# Altium schematic sheet Voltage Regulator.SchDoc
size Letter; Organization: Midnight Sun Solar Rayce Car Team; Address1: University of Waterloo; Address2: 200 University Ave W; Address3: Waterloo, ON, Canada; Address4: N2L 3E9; Website: www.uwmidsun.com
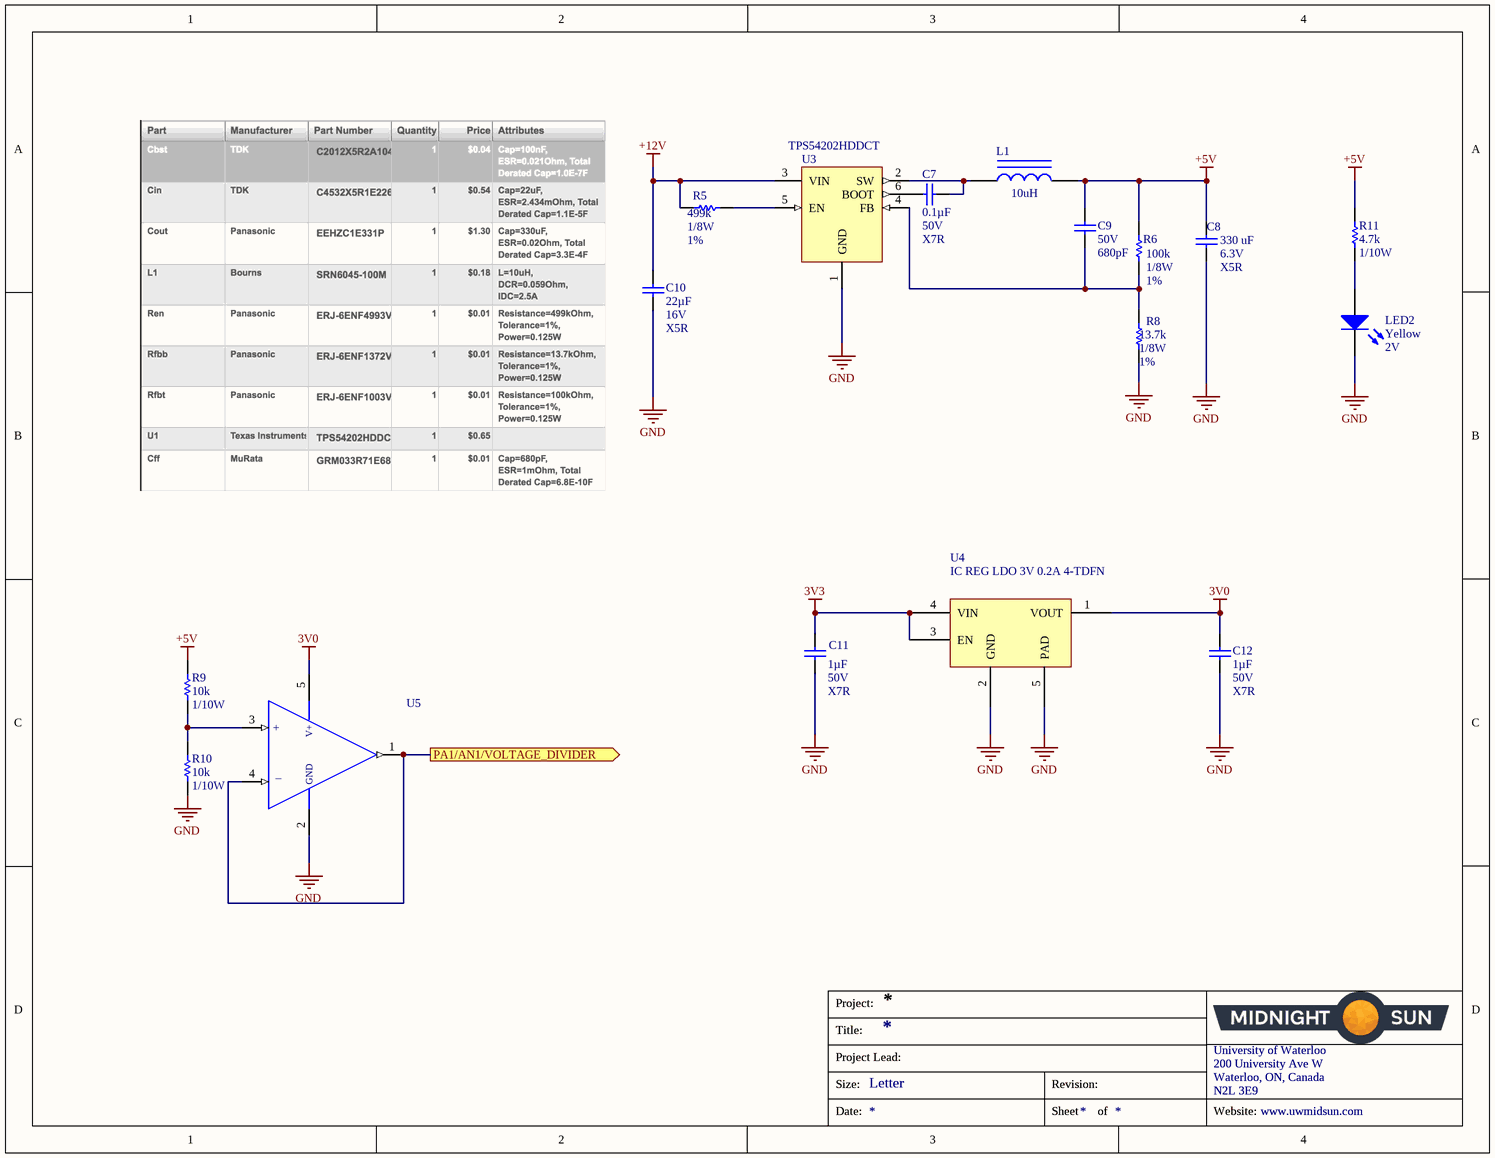
[diagram p0: Voltage Regulator.SchDoc]

## Parts
C7  Capacitance: 0.1µF  Voltage: 50V  Temperature Coefficient: X7R  [CAP, 0603]  (hidden comment: CAP CER 0.1UF 50V 10% X7R 0603)
C8  Capacitance: 330 uF  Voltage: 6.3V  Temperature Coefficient: X5R  [CAP, 1210]  (hidden comment: CAP CER 330UF 6.3V X5R 1210)
C9  Voltage: 50V  Capacitance: 680pF  [CAP, 0603]  (hidden comment: CAP CER 680PF 50V C0G/NP0 0603)
C10  Capacitance: 22µF  Voltage: 16V  Temperature Coefficient: X5R  [CAP, 1210]  (hidden comment: CAP CER 22UF 16V ±20% X5R 1210)
C11  Capacitance: 1µF  Voltage: 50V  Temperature Coefficient: X7R  [CAP, 0603]  (hidden comment: CAP CER 1UF 50V 10% X7R 0603)
C12  Capacitance: 1µF  Voltage: 50V  Temperature Coefficient: X7R  [CAP, 0603]  (hidden comment: CAP CER 1UF 50V 10% X7R 0603)
L1  Inductance: 10uH  [INDP100102X31N]  (hidden comment: IND 10UH 2.8A 59 MOHM SMD)
LED2  Color: Yellow  Voltage - Forward (Vf) (Typ): 2V  [LED_0603]  (hidden comment: LED YELLOW CLEAR 2.1V 0603)
R5  Resistance: 499k  Tolerance: 1%  Max Power Dissipation: 1/8W  [RES 1206]  (hidden comment: RES 499K OHM 1% 1/4W 1206)
R6  Tolerance: 1%  Resistance: 100k  Power Rating: 1/8W  [RES 1206]  (hidden comment: ES 100K OHM 1% 1/4W 1206)
R8  Resistance: 13.7k  Tolerance: 1%  Power Rating: 1/8W  [RES 1206]  (hidden comment: RES 13.7K OHM 1% 1/4W 1206)
R9  Resistance: 10k  Power: 1/10W  [RES, 0603]  (hidden comment: RES 10K OHM 1% 1/10W 0603)
R10  Resistance: 10k  Power: 1/10W  [RES, 0603]  (hidden comment: RES 10K OHM 1% 1/10W 0603)
R11  Resistance (Ohms): 4.7k  Power (Watts): 1/10W  [RES, 0603]  (hidden comment: RES 4.7K OHM 1% 1/10W 0603)
U3  Manufacturer Part Number: TPS54202HDDCT  [SOT23-6]  (hidden comment: IC REG BUCK ADJ 2A SYNC 6SOT)
U4  IC REG LDO 3V 0.2A 4-TDFN  [IC REG LDO 3V 0.2A 4-TDFN]
U5  IC OP AMP GEN PURPOSE RR 10MHZ SOT-23-5  [IC OP AMP GP RR 10MHZ SOT-23-5]  (value not drawn)

## Ports
PA1/AN1/VOLTAGE_DIVIDER (out)

## Nets
3V0: C12.1 U4.1(VOUT) U5.5(VDD)
3V3: C11.1 U4.3(EN) U4.4(VIN)
+5V: C8.1 C9.1 L1.2 R6.1 R9.1 R11.1
+12V: C10.1 R5.2 U3.3(VIN)
GND: C8.2 C10.2 C11.2 C12.2 LED2.2(K) R8.2 R10.2 U3.1(GND) U4.2(GND) U4.5(PAD) U5.2(VSS)
PA1/AN1/VOLTAGE_DIVIDER: U5.1(OUTPUT) U5.4(-IN) ; port PA1/AN1/VOLTAGE_DIVIDER
NetC7_1: C7.1 U3.6(BOOT)
NetC7_2: C7.2 L1.1 U3.2(SW)
NetC9_2: C9.2 R6.2 R8.1 U3.4(FB)
NetLED2_1: LED2.1(A) R11.2
NetR5_1: R5.1 U3.5(EN)
NetR9_2: R9.2 R10.1 U5.3(+IN)

## Notes on the sheet
- Project:
- Title:
- Size:
- Project Lead:
- Letter
- Revision:
- University of Waterloo
- 200 University Ave W
- Waterloo, ON, Canada
- N2L 3E9
- Date:
- Sheet
- of
- Website:
- (in symbol IC OP AMP GEN PURPOSE RR 10MHZ SOT-23-5) V+; +; GND; _

## Library data of the parts
C7 = CAP CER 0.1UF 50V 10% X7R 0603: 0.10µF ±10% 50V Ceramic Capacitor X7R 0603 (1608 Metric); Manufacturer 1: AVX Corporation; Manufacturer Part Number 1: 06035C104KAT2A; Supplier 1: Digi-Key; Supplier Part Number 1: 478-5052-1-ND; Packaging: Cut Tape (CT); Part Status: Active; Operating Temperature: -55°C ~ 125°C; Ratings: -; Mounting Type: Surface Mount, MLCC; Package / Case: 0603 (1608 Metric); Size / Dimension: 0.063" L x 0.032" W (1.60mm x 0.81mm); Height - Seated (Max): -; Thickness (Max): 0.035" (0.90mm); Lead Spacing: -; Lead Style: -; ComponentLink1URL: http://datasheets.avx.com/X7RDielectric.pdf; ComponentLink1Description: http://datasheets.avx.com/X7RDielectric.pdf; Tolerance: ±10%
C8 = CAP CER 330UF 6.3V X5R 1210: 330µF ±20% 6.3V Ceramic Capacitor X5R 1210 (3225 Metric); Manufacturer: Taiyo Yuden; Manufacturer Part Number: JMK325ABJ337MM-P; Supplier 1: Digi-Key; Stock 1: 334; Pricing 1: 1=5.57, 10=4.492, 100=3.5039, 500=2.60546 (USD); ComponentLink1URL: http://ds.yuden.co.jp/TYCOMPAS/ut/detail.do?productNo=JMK325ABJ337MM-P&fileName=JMK325ABJ337MM-P_SS&mode=specSheetDownload; ComponentLink1Description: http://ds.yuden.co.jp/TYCOMPAS/ut/detail.do?productNo=JMK325ABJ337MM-P&fileName=JMK325ABJ337MM-P_SS&mode=specSheetDownload; Supplier Part Number 1: 587-5449-1-ND
C9 = CAP CER 680PF 50V C0G 0603: 680pF ±5% 50V Ceramic Capacitor C0G, NP0 0603 (1608 Metric); Manufacturer: Samsung; Manufacturer Part Number: CL10C681JB8NNNC; Temperature Coefficient: 300ppm/°C; Supplier 1: Digi-Key; Stock 1: 40000; Pricing 1: 1=0.16, 10=0.112, 100=0.0526, 500=0.0369, 1000=0.03055 (USD); Mount: Surface Mount; Case/Package: 0603; Case Code (Metric): 1608; Case Code (Imperial): 0603; Material: Ceramic; Min Operating Temperature: -55°C; Max Operating Temperature: 125°C; Tolerance: 5%; Packaging: Tape and Reel; Voltage Rating: 50V; Dielectric: C0G; Voltage Rating (DC): 50V; Length: 1.6mm; Height: 0.8mm; Width: 0.031inch; Thickness: 0.035inch; Depth: 0.8mm; Radiation Hardening: No; Lead Free: Lead Free; ComponentLink1URL: http://www.samsungsem.com/kr/support/product-search/mlcc/CL10C681JB8NNNC.jsp; ComponentLink1Description: http://www.samsungsem.com/kr/support/product-search/mlcc/CL10C681JB8NNNC.jsp; ComponentLink2URL: https://www.verical.com/server-webapp/html/getDatasheet?partID=359565; ComponentLink2Description: https://www.verical.com/server-webapp/html/getDatasheet?partID=359565; ComponentLink3URL: http://www1.futureelectronics.com/doc/SAMSUNG%20PASSIVE/CL05B104KQ5NNNC.pdf; ComponentLink3Description: http://www1.futureelectronics.com/doc/SAMSUNG%20PASSIVE/CL05B104KQ5NNNC.pdf; ComponentLink4URL: http://www.rapidonline.com/pdf/71-0310.pdf; ComponentLink4Description: http://www.rapidonline.com/pdf/71-0310.pdf; ComponentLink5URL: https://www.distrelec.biz/Web/Downloads/_e/ng/MLCC_CatalogDownload2013_ENG.pdf?mime=application%2Fpdf; ComponentLink5Description: https://www.distrelec.biz/Web/Downloads/_e/ng/MLCC_CatalogDownload2013_ENG.pdf?mime=application%2Fpdf; ComponentLink6URL: https://produktinfo.conrad.com/datenblaetter/450000-474999/456146-da-01-en-VS_KONDENSATOR_0603.pdf; ComponentLink6Description: https://produktinfo.conrad.com/datenblaetter/450000-474999/456146-da-01-en-VS_KONDENSATOR_0603.pdf; Supplier Part Number 1: 1276-1820-1-ND
C10 = CAP CER 22UF 16V ±20% X5R 1210: 22µF ±20% 16V Ceramic Capacitor X5R 1210 (3225 Metric); Manufacturer 1: Murata Electronics North America; Manufacturer Part Number 1: GRM32ER61C226ME20L; Supplier 1: Digi-Key; Supplier Part Number 1: 490-1881-1-ND; Packaging: Cut Tape (CT); Part Status: Active; Operating Temperature: -55°C ~ 85°C; Ratings: -; Mounting Type: Surface Mount, MLCC; Package / Case: 1210 (3225 Metric); Size / Dimension: 0.126" L x 0.098" W (3.20mm x 2.50mm); Height - Seated (Max): -; Thickness (Max): 0.106" (2.70mm); Lead Spacing: -; Lead Style: -; ComponentLink1URL: http://www.murata.com/~/media/webrenewal/support/library/catalog/products/capacitor/mlcc/c02e.ashx; ComponentLink1Description: http://www.murata.com/~/media/webrenewal/support/library/catalog/products/capacitor/mlcc/c02e.ashx; Tolerance: ±20%
C11 C12 = CAP CER 1UF 50V 10% X7R 0603: 1µF ±10% 50V Ceramic Capacitor X7R 0603 (1608 Metric); Manufacturer 1: Taiyo Yuden; Manufacturer Part Number 1: UMK107AB7105KA-T; Supplier 1: Digi-Key; Supplier Part Number 1: 587-3247-1-ND; Packaging: Cut Tape (CT); Part Status: Active; Operating Temperature: -55°C ~ 125°C; Ratings: -; Mounting Type: Surface Mount, MLCC; Package / Case: 0603 (1608 Metric); Size / Dimension: 0.063" L x 0.031" W (1.60mm x 0.80mm); Height - Seated (Max): -; Thickness (Max): 0.037" (0.95mm); Lead Spacing: -; Lead Style: -; ComponentLink1URL: http://www.yuden.co.jp/productdata/catalog/en/mlcc_all_e.pdf; ComponentLink1Description: http://www.yuden.co.jp/productdata/catalog/en/mlcc_all_e.pdf; Tolerance: ±10%
L1 = IND 10UH 2.8A 59 MOHM SMD: 10µH Shielded Inductor 2.8A 59 mOhm Max Nonstandard; Manufacturer: Sumida; Manufacturer Part Number: CDRH103RNP-100NC-B; Core Material: Ferrite; Tolerance: 30%; Saturation Current: 3.18A; DC Resistance (DCR): 59mR; Test Frequency: 100kHz; Supplier 1: Digi-Key; Stock 1: 69; Pricing 1: 1=1.53, 10=1.42, 100=1.027, 500=0.7866 (USD); Mount: Surface Mount; Case/Package: Nonstandard; Min Operating Temperature: -40°C; Max Operating Temperature: 100°C; Packaging: Tape and Reel; Package Quantity: 1000; Current Rating: 2.8A; Shielding: Shielded; Max DC Current: 2.8A; Termination: SMD/SMT; Length: 0.402inch; Height: 3.1mm; Width: 0.394inch; Height - Seated (Max): 0.122inch; Depth: 10.3mm; Radiation Hardening: No; Lead Free: Lead Free; ComponentLink1URL: http://www.mouser.com/ds/2/390/CDRH103R-523372.pdf; ComponentLink1Description: http://www.mouser.com/ds/2/390/CDRH103R-523372.pdf; ComponentLink2URL: http://www.sumida.com/products/pdf/CDRH103R.pdf; ComponentLink2Description: http://www.sumida.com/products/pdf/CDRH103R.pdf; ComponentLink3URL: http://products.sumida.com/products/pdf/CDRH103R.pdf; ComponentLink3Description: http://products.sumida.com/products/pdf/CDRH103R.pdf; Supplier Part Number 1: 308-1910-1-ND
LED2 = LED YELLOW CLEAR 2.1V 0603: Yellow 590nm LED Indication - Discrete 2V 0603 (1608 Metric); Manufacturer: Wurth Electronics Inc.; Manufacturer Part Number: 150060YS75000; Lens Color: Colorless; Millicandela Rating: 120mcd; Lens Style/Size: Rectangle with Flat Top, 1.10mm x 0.70mm; Current - Test: 20mA; Viewing Angle: 140°; Wavelength - Peak: 595nm; Supplier 1: Digi-Key; RoHS: RoHS Compliant; Category: Optoelectronics; Stock 1: 10523; Pricing 1: 1=0.21, 100=0.1617, 500=0.13964 (CAD); Packaging: Cut Tape (CT); Part Status: Active; Lens Transparency: Clear; Mounting Type: Surface Mount; Wavelength - Dominant: 590nm; Features: -; Package / Case: 0603 (1608 Metric); Supplier Device Package: 0603; Size / Dimension: 1.60mm L x 0.80mm W; Height (Max): 0.80mm; ComponentLink1URL: http://katalog.we-online.de/led/datasheet/150060YS75000.pdf; ComponentLink1Description: http://katalog.we-online.de/led/datasheet/150060YS75000.pdf; Supplier Part Number 1: 732-4981-1-ND
R5 = RES 499K OHM 1% 1/4W 1206: Manufacturer: Stackpole Electronics; Manufacturer Part Number: RMCF1206FT499K; Temperature Coefficient: 100ppm/°C; Supplier 1: Digi-Key; Stock 1: 60246; Pricing 1: 1=0.1, 10=0.035, 100=0.0141, 1000=0.00635, 2500=0.00552 (USD); Mount: Surface Mount; Case/Package: 1206; Case Code (Metric): 3216; Case Code (Imperial): 1206; Contact Plating: Tin,Matte; Min Operating Temperature: -55°C; Max Operating Temperature: 155°C; Packaging: Tape and Reel; Composition: Thick Film; Number of Terminations: 2; Length: 0.126inch; Height: 0.028inch; Width: 0.063inch; Radiation Hardening: No; ComponentLink1URL: https://www.seielect.com/Catalog/SEI-RMCF_RMCP.pdf; ComponentLink1Description: https://www.seielect.com/Catalog/SEI-RMCF_RMCP.pdf; ComponentLink2URL: http://components.arrow.com/part/dataview/50498553S9833735N1174; ComponentLink2Description: http://components.arrow.com/part/dataview/50498553S9833735N1174; Supplier Part Number 1: RMCF1206FT499KCT-ND
R6 = RES 100K OHM 1% 1/4W 1206: 100 kOhms ±1% 0.25W, 1/4W Chip Resistor 1206 (3216 Metric) Moisture Resistant Thick Film; Manufacturer: Yageo; Manufacturer Part Number: RC1206FR-07100KL; Temperature Coefficient: 100ppm/°C; Voltage Rating: 200V; Supplier 1: Digi-Key; Stock 1: 1498131; Pricing 1: 1=0.1, 10=0.033, 100=0.0136, 1000=0.0061, 2500=0.00529 (USD); Case/Package: 1206; Case Code (Imperial): 1206; Case Code (Metric): 3216; Min Operating Temperature: -55°C; Max Operating Temperature: 155°C; Packaging: Tape and Reel; Termination: SMD/SMT; Composition: Thick Film; Length: 3.1mm; Height: 0.55mm; Depth: 1.6mm; REACH SVHC: No SVHC; Lead Free: Lead Free; ComponentLink1URL: https://datasheet.ciiva.com/7857/444357-7857239.pdf; ComponentLink1Description: https://datasheet.ciiva.com/7857/444357-7857239.pdf; ComponentLink2URL: https://datasheet.ciiva.com/7857/444357-7857240.pdf; ComponentLink2Description: https://datasheet.ciiva.com/7857/444357-7857240.pdf; ComponentLink3URL: https://datasheet.ciiva.com/16997/pyu-rc1206-51-rohs-l-4-16997053.pdf; ComponentLink3Description: https://datasheet.ciiva.com/16997/pyu-rc1206-51-rohs-l-4-16997053.pdf; Supplier Part Number 1: 311-100KFRCT-ND
R8 = RES 13.7K OHM 1% 1/4W 1206: 13.7 kOhms ±1% 0.25W, 1/4W Chip Resistor 1206 (3216 Metric) Moisture Resistant Thick Film; Manufacturer: Yageo; Manufacturer Part Number: RC1206FR-0713K7L; Voltage Rating: 200V; Temperature Coefficient: 100ppm/°C; Supplier 1: Digi-Key; Stock 1: 44928; Pricing 1: 1=0.1, 10=0.033, 100=0.0136, 1000=0.0061, 2500=0.00529 (USD); Case/Package: 1206; Case Code (Imperial): 1206; Case Code (Metric): 3216; Contact Plating: Tin,Matte; Min Operating Temperature: -55°C; Max Operating Temperature: 155°C; Packaging: Tape and Reel; Termination: SMD/SMT; Composition: Thick Film; Military Standard: Not; Voltage Rating (DC): 200V; Length: 3.1mm; Height: 0.55mm; Width: 1.6mm; Depth: 1.6mm; Radiation Hardening: No; Lead Free: Lead Free; ComponentLink1URL: http://components.arrow.com/part/dataview/0323_03537901; ComponentLink1Description: http://components.arrow.com/part/dataview/0323_03537901; ComponentLink2URL: http://www.yageo.com/documents/recent/PYu-RC_Group_51_RoHS_L_2.pdf; ComponentLink2Description: http://www.yageo.com/documents/recent/PYu-RC_Group_51_RoHS_L_2.pdf; ComponentLink3URL: http://www.yageo.com/documents/recent/PYu-RC1206_51_RoHS_L-4.pdf; ComponentLink3Description: http://www.yageo.com/documents/recent/PYu-RC1206_51_RoHS_L-4.pdf; ComponentLink4URL: http://www.yageo.com.tw/exep/pages/download/literatures/PYu-R_INT-thick_7.pdf; ComponentLink4Description: http://www.yageo.com.tw/exep/pages/download/literatures/PYu-R_INT-thick_7.pdf; ComponentLink5URL: http://www.mouser.com/ds/2/447/PYu-RC1206_51_RoHS_L-4-349080.pdf; ComponentLink5Description: http://www.mouser.com/ds/2/447/PYu-RC1206_51_RoHS_L-4-349080.pdf; ComponentLink6URL: http://www.yageo.com/documents/recent/PYu-RC1206_51_RoHS_L_5.pdf; ComponentLink6Description: http://www.yageo.com/documents/recent/PYu-RC1206_51_RoHS_L_5.pdf; Supplier Part Number 1: 311-13.7KFRCT-ND
R9 R10 = RES 10K OHM 1% 1/10W 0603: RES SMD 10K OHM 1% 1/10W 0603; Manufacturer 1: Yageo; Manufacturer Part Number 1: RC0603FR-0710KL; Temperature Coefficient: ±100ppm/°C; Supplier 1: Digi-Key; Supplier Part Number 1: 311-10.0KHRCT-ND; Packaging: Cut Tape (CT); Part Status: Active; Composition: Thick Film; Operating Temperature: -55°C ~ 155°C; Package / Case: 0603 (1608 Metric); Supplier Device Package: 0603; Size / Dimension: 0.063" L x 0.031" W (1.60mm x 0.80mm); Height - Seated (Max): 0.022" (0.55mm); Failure Rate: -; ComponentLink1URL: http://www.yageo.com/documents/recent/PYu-RC_Group_51_RoHS_L_7.pdf; ComponentLink1Description: http://www.yageo.com/documents/recent/PYu-RC_Group_51_RoHS_L_7.pdf; Tolerance: ±1%
R11 = RES 4.7K OHM 1% 1/10W 0603: 4.7k Ohm ±1% 0.1W, 1/10W Chip Resistor 0603 (1608 Metric) Moisture Resistant Thick Film; Manufacturer 1: Yageo; Manufacturer Part Number 1: RC0603FR-074K7L; Description 1: RES SMD 4.7K OHM 1% 1/10W 0603; Temperature Coefficient: ±100ppm/°C; Supplier 1: Digi-Key; Supplier Part Number 1: 311-4.70KHRCT-ND; RoHS: RoHS Compliant; Category: Resistors; Stock 1: 3487566; Pricing 1: 1=0.16, 10=0.022, 100=0.0089, 1000=0.00402, 2500=0.00349 (CAD); Packaging: Cut Tape (CT); Part Status: Active; Composition: Thick Film; Features: Moisture Resistant; Operating Temperature: -55°C ~ 155°C; Package / Case: 0603 (1608 Metric); Supplier Device Package: 0603; Size / Dimension: 0.063" L x 0.031" W (1.60mm x 0.80mm); Height - Seated (Max): 0.022" (0.55mm); Failure Rate: -; ComponentLink1URL: http://www.yageo.com/documents/recent/PYu-RC_Group_51_RoHS_L_7.pdf; ComponentLink1Description: http://www.yageo.com/documents/recent/PYu-RC_Group_51_RoHS_L_7.pdf; Tolerance: ±1%
U3 = IC REG BUCK ADJ 2A SYNC 6SOT: Buck Switching Regulator IC Positive Adjustable 0.596V 1 Output 2A SOT-23-6 Thin, TSOT-23-6; Manufacturer: Texas Instruments; Min Input Voltage: 4.5V; Max Input Voltage: 28V; Number of Outputs: 1; Min Output Voltage: 600mV; Max Output Voltage: 26V; Switching Frequency: 500kHz; Quiescent Current: 40uA; Supplier 1: Digi-Key; Stock 1: 2574; Pricing 1: 1=2, 10=1.796, 100=1.4436 (USD); Case/Package: SOT-6; Number of Pins: 6; Min Operating Temperature: -40°C; Max Operating Temperature: 125°C; Output Current: 2A; Packaging: Cut Tape; Output Voltage: 26V; REACH SVHC: No SVHC; Lead Free: Lead Free; ComponentLink1URL: http://www.ti.com/lit/ds/symlink/tps54202h.pdf; ComponentLink1Description: http://www.ti.com/lit/ds/symlink/tps54202h.pdf; ComponentLink2URL: http://www.ti.com/general/docs/lit/getliterature.tsp?genericPartNumber=TPS54202H&amp;&amp;fileType=pdf; ComponentLink2Description: http://www.ti.com/general/docs/lit/getliterature.tsp?genericPartNumber=TPS54202H&amp;&amp;fileType=pdf; ComponentLink3URL: http://www.ti.com/general/docs/lit/getliterature.tsp?genericPartNumber=TPS54202H&&fileType=pdf; ComponentLink3Description: http://www.ti.com/general/docs/lit/getliterature.tsp?genericPartNumber=TPS54202H&&fileType=pdf; Supplier Part Number 1: 296-44497-1-ND
U4 = IC REG LDO 3V 0.2A 4-TDFN: Manufacturer: Microchip Technology; Manufacturer Part Number: MIC94310-PYMT-TR; Regulator Topology: Positive Fixed; Current - Output: 200mA; Voltage - Dropout (Typical): 0.04V @ 200mA; Voltage - Input: Up to 3.6V; Current - Limit (Min): 250mA; Supplier 1: Digi-Key; RoHS: RoHS Compliant; Category: Integrated Circuits (ICs); Stock 1: 4802; Pricing 1: 1=0.45, 25=0.3708, 100=0.3386 (CAD); Packaging: Cut Tape (CT); Part Status: Active; Voltage - Output: 3V; Operating Temperature: -40°C ~ 125°C; Mounting Type: Surface Mount; Package / Case: 4-UFDFN Exposed Pad; Supplier Device Package: 4-TDFN (1.2x1.6); ComponentLink1URL: http://www.microchip.com/mymicrochip/filehandler.aspx?ddocname=en580409; ComponentLink1Description: http://www.microchip.com/mymicrochip/filehandler.aspx?ddocname=en580409; Supplier Part Number 1: 576-4761-1-ND
U5 = IC OP AMP GEN PURPOSE RR 10MHZ SOT-23-5: General Purpose Amplifier 1 Circuit Rail-to-Rail SOT-23-5; Manufacturer 1: Texas Instruments; Manufacturer Part Number 1: TLV316QDBVRQ1; Description 1: IC OP AMP GP RR 10MHZ 5-SOT-23; Number of Circuits: 1; Slew Rate: 6 V/µs; Current - Supply: 400µA; Current - Output / Channel: 50mA; Voltage - Supply, Single/Dual (±): 1.8 V ~ 5.5 V, ±0.9 V ~ 2.75 V; Supplier 1: Digi-Key; Supplier Part Number 1: 296-45323-1-ND; RoHS: RoHS Compliant; Category: Integrated Circuits (ICs); Stock 1: 1747; Pricing 1: 1=1.33, 10=1.185, 100=0.9234, 500=0.76276, 1000=0.60218 (CAD); Packaging: Cut Tape (CT); Part Status: Active; Amplifier Type: General Purpose; Output Type: Rail-to-Rail; -3db Bandwidth: -; Operating Temperature: -40°C ~ 125°C; Mounting Type: Surface Mount; Package / Case: SC-74A, SOT-753; Supplier Device Package: SOT-23-5; ComponentLink1URL: http://www.ti.com/lit/ds/symlink/tlv316-q1.pdf; ComponentLink1Description: http://www.ti.com/lit/ds/symlink/tlv316-q1.pdf